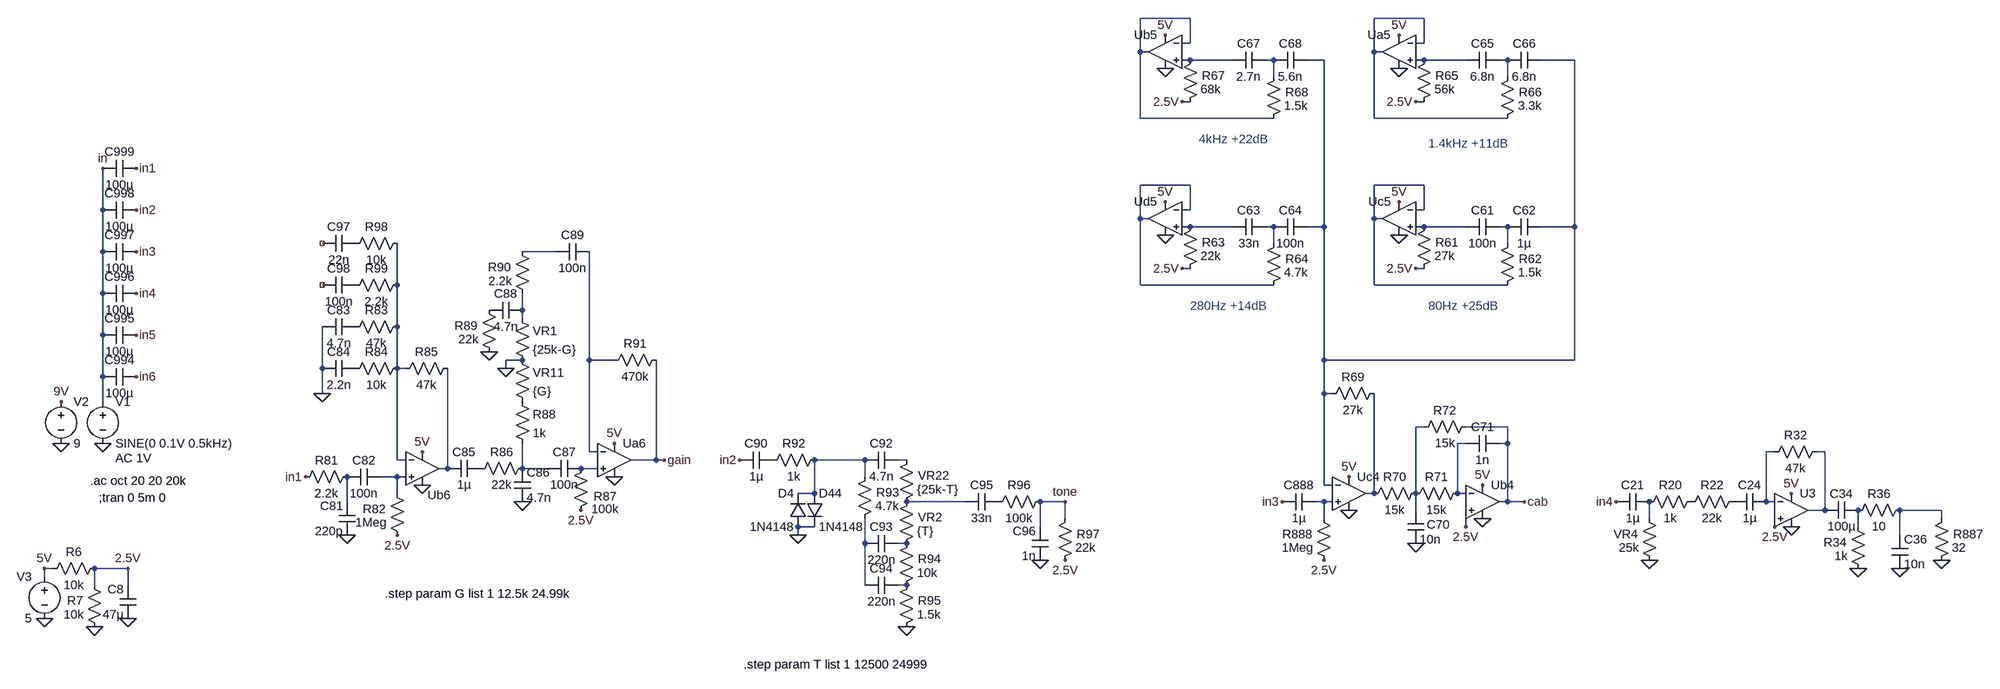
[diagram p0: schematic amPlug2ClassicRock.asc]
amPlug2ClassicRock.asc, the LTspice schematic file:
Version 4
SHEET 1 3408 3732
WIRE 608 336 512 336
WIRE 1056 336 960 336
WIRE 608 384 608 336
WIRE 608 384 592 384
WIRE 1056 384 1056 336
WIRE 1056 384 1040 384
WIRE 512 400 512 336
WIRE 528 400 512 400
WIRE 960 400 960 336
WIRE 976 400 960 400
WIRE 608 416 592 416
WIRE 688 416 608 416
WIRE 768 416 752 416
WIRE 864 416 832 416
WIRE 1056 416 1040 416
WIRE 1136 416 1056 416
WIRE 1216 416 1200 416
WIRE 1344 416 1280 416
WIRE 768 448 768 416
WIRE 1216 448 1216 416
WIRE 608 496 592 496
WIRE 1056 496 1040 496
WIRE 512 528 512 400
WIRE 768 528 512 528
WIRE 960 528 960 400
WIRE 1216 528 960 528
WIRE 608 656 512 656
WIRE 1056 656 960 656
WIRE -1568 704 -1568 624
WIRE 608 704 608 656
WIRE 608 704 592 704
WIRE 1056 704 1056 656
WIRE 1056 704 1040 704
WIRE 512 720 512 656
WIRE 528 720 512 720
WIRE 960 720 960 656
WIRE 976 720 960 720
WIRE 608 736 592 736
WIRE 688 736 608 736
WIRE 768 736 752 736
WIRE 864 736 864 416
WIRE 864 736 832 736
WIRE 1056 736 1040 736
WIRE 1136 736 1056 736
WIRE 1216 736 1200 736
WIRE 1344 736 1344 416
WIRE 1344 736 1280 736
WIRE 768 768 768 736
WIRE 1216 768 1216 736
WIRE -1568 784 -1568 704
WIRE -608 784 -672 784
WIRE 608 816 592 816
WIRE 1056 816 1040 816
WIRE -912 848 -912 768
WIRE 512 848 512 720
WIRE 768 848 512 848
WIRE 960 848 960 720
WIRE 1216 848 960 848
WIRE -1568 864 -1568 784
WIRE -672 896 -672 864
WIRE -672 912 -672 896
WIRE -912 928 -912 848
WIRE -1568 944 -1568 864
WIRE -672 992 -704 992
WIRE -544 992 -544 784
WIRE -496 992 -544 992
WIRE 864 992 864 736
WIRE 1344 992 1344 736
WIRE 1344 992 864 992
WIRE -1056 1008 -1056 928
WIRE -912 1008 -912 928
WIRE -896 1008 -912 1008
WIRE -704 1008 -704 992
WIRE -1568 1024 -1568 944
WIRE -1056 1056 -1056 1008
WIRE 864 1056 864 992
WIRE 880 1056 864 1056
WIRE -1568 1072 -1568 1024
WIRE 1056 1120 1040 1120
WIRE 1216 1120 1136 1120
WIRE 1136 1152 1120 1152
WIRE 1216 1152 1216 1120
WIRE 1216 1152 1200 1152
WIRE -544 1168 -544 992
WIRE -528 1168 -544 1168
WIRE 1728 1168 1712 1168
WIRE 1824 1168 1808 1168
WIRE -912 1184 -912 1008
WIRE -896 1184 -912 1184
WIRE -416 1184 -416 992
WIRE -416 1184 -464 1184
WIRE -400 1184 -416 1184
WIRE -16 1184 -112 1184
WIRE 64 1184 48 1184
WIRE -816 1200 -816 1008
WIRE -816 1200 -832 1200
WIRE -672 1200 -672 1152
WIRE -624 1200 -672 1200
WIRE -528 1200 -560 1200
WIRE -912 1216 -944 1216
WIRE -896 1216 -912 1216
WIRE -16 1216 -16 1184
WIRE 864 1232 864 1056
WIRE 880 1232 864 1232
WIRE -912 1248 -912 1216
WIRE -112 1248 -112 1184
WIRE -112 1248 -144 1248
WIRE 960 1248 960 1056
WIRE 960 1248 944 1248
WIRE 1040 1248 1040 1120
WIRE 1120 1248 1120 1152
WIRE 1136 1248 1120 1248
WIRE -1008 1264 -1008 1216
WIRE 176 1264 64 1264
WIRE 368 1264 320 1264
WIRE 864 1264 848 1264
WIRE 880 1264 864 1264
WIRE 1216 1264 1216 1152
WIRE 1216 1264 1200 1264
WIRE 1248 1264 1216 1264
WIRE 1712 1264 1712 1168
WIRE 1728 1264 1712 1264
WIRE 1040 1280 1040 1248
WIRE 1824 1280 1824 1168
WIRE 1824 1280 1792 1280
WIRE 2048 1280 1968 1280
WIRE 368 1296 368 1264
WIRE 864 1296 864 1264
WIRE 1488 1296 1488 1264
WIRE 2048 1296 2048 1280
WIRE -112 1312 -144 1312
WIRE 320 1312 320 1264
WIRE 1136 1312 1136 1280
WIRE 1728 1312 1728 1296
WIRE 1888 1312 1888 1280
WIRE -144 1328 -144 1312
WIRE 1968 1328 1968 1280
WIRE -16 1344 -16 1296
WIRE 64 1344 48 1344
WIRE -1664 1392 -1680 1392
WIRE -1520 1392 -1584 1392
WIRE -1680 1408 -1680 1392
WIRE -1584 1424 -1584 1392
WIRE -1520 1424 -1520 1392
WIRE -16 1424 -16 1344
WIRE 64 1424 48 1424
FLAG -1568 1152 0
FLAG -1568 624 in
FLAG -1648 1152 0
FLAG -1648 1072 9V
FLAG -1504 624 in1
FLAG -1504 704 in2
FLAG -1504 784 in3
FLAG -1504 864 in4
FLAG -1504 944 in5
FLAG -1504 1024 in6
FLAG -1088 1216 in1
FLAG -864 1168 5V
FLAG -864 1232 0
FLAG -1584 1504 0
FLAG -1520 1488 0
FLAG -1520 1392 2.5V
FLAG -1056 1056 0
FLAG -672 1264 0
FLAG -560 1280 2.5V
FLAG -1680 1488 0
FLAG -1680 1392 5V
FLAG -1008 1328 0
FLAG -912 1328 2.5V
FLAG -496 1152 5V
FLAG -496 1216 0
FLAG 64 1504 0
FLAG 320 1376 0
FLAG 368 1376 2.5V
FLAG 912 1216 5V
FLAG 912 1280 0
FLAG 864 1376 2.5V
FLAG 592 816 2.5V
FLAG 784 1264 in3
FLAG 592 496 2.5V
FLAG 1040 816 2.5V
FLAG 1040 496 2.5V
FLAG 1168 1232 5V
FLAG 1168 1296 0
FLAG 1040 1344 0
FLAG 1488 1376 0
FLAG 1760 1248 5V
FLAG 1760 1312 0
FLAG 1728 1312 2.5V
FLAG 1888 1392 0
FLAG 1968 1392 0
FLAG 1424 1264 in4
FLAG 2048 1376 0
FLAG -400 1184 gain
FLAG 368 1264 tone
FLAG 1248 1264 cab
FLAG -736 976 0
FLAG -704 1008 0
FLAG -144 1328 0
FLAG 1136 1312 2.5V
FLAG 560 368 5V
FLAG 560 432 0
FLAG 1008 368 5V
FLAG 1008 432 0
FLAG 560 688 5V
FLAG 560 752 0
FLAG 1008 688 5V
FLAG 1008 752 0
FLAG -256 1184 in2
SYMBOL voltage -1568 1056 R0
WINDOW 123 24 124 Left 2
WINDOW 39 0 0 Left 2
SYMATTR Value2 AC 1V
SYMATTR InstName V1
SYMATTR Value SINE(0 0.1V 0.5kHz)
SYMBOL voltage -1648 1056 R0
WINDOW 123 0 0 Left 0
WINDOW 39 0 0 Left 0
SYMATTR InstName V2
SYMATTR Value 9
SYMBOL cap -1504 688 R90
WINDOW 0 0 32 VBottom 2
WINDOW 3 32 32 VTop 2
SYMATTR InstName C998
SYMATTR Value 100µ
SYMBOL cap -1504 768 R90
WINDOW 0 0 32 VBottom 2
WINDOW 3 32 32 VTop 2
SYMATTR InstName C997
SYMATTR Value 100µ
SYMBOL cap -1504 848 R90
WINDOW 0 0 32 VBottom 2
WINDOW 3 32 32 VTop 2
SYMATTR InstName C996
SYMATTR Value 100µ
SYMBOL cap -1504 608 R90
WINDOW 0 0 32 VBottom 2
WINDOW 3 32 32 VTop 2
SYMATTR InstName C999
SYMATTR Value 100µ
SYMBOL cap -1504 928 R90
WINDOW 0 0 32 VBottom 2
WINDOW 3 32 32 VTop 2
SYMATTR InstName C995
SYMATTR Value 100µ
SYMBOL cap -1504 1008 R90
WINDOW 0 0 32 VBottom 2
WINDOW 3 32 32 VTop 2
SYMATTR InstName C994
SYMATTR Value 100µ
SYMBOL cap -944 1200 R90
WINDOW 0 0 32 VBottom 2
WINDOW 3 32 32 VTop 2
SYMATTR InstName C82
SYMATTR Value 100n
SYMBOL res -992 1200 R90
WINDOW 0 0 56 VBottom 2
WINDOW 3 32 56 VTop 2
SYMATTR InstName R81
SYMATTR Value 2.2k
SYMBOL Opamps\\UniversalOpamp2 -864 1200 R0
WINDOW 0 10 51 Left 2
SYMATTR InstName Ub6
SYMBOL res -800 992 R90
WINDOW 0 0 56 VBottom 2
WINDOW 3 32 56 VTop 2
SYMATTR InstName R85
SYMATTR Value 47k
SYMBOL res -1568 1376 R90
WINDOW 0 0 56 VBottom 2
WINDOW 3 32 56 VTop 2
SYMATTR InstName R6
SYMATTR Value 10k
SYMBOL res -1568 1520 R180
WINDOW 0 38 66 Left 2
WINDOW 3 36 40 Left 2
SYMATTR InstName R7
SYMATTR Value 10k
SYMBOL cap -1504 1488 R180
WINDOW 0 24 56 Left 2
WINDOW 3 24 8 Left 2
SYMATTR InstName C8
SYMATTR Value 47µ
SYMBOL res -896 1344 R180
WINDOW 0 38 66 Left 2
WINDOW 3 36 40 Left 2
SYMATTR InstName R82
SYMATTR Value 1Meg
SYMBOL res -896 992 R90
WINDOW 0 0 56 VBottom 2
WINDOW 3 32 56 VTop 2
SYMATTR InstName R84
SYMATTR Value 10k
SYMBOL cap -1056 1024 R270
WINDOW 0 32 32 VTop 2
WINDOW 3 0 32 VBottom 2
SYMATTR InstName C84
SYMATTR Value 2.2n
SYMBOL cap -752 1184 R90
WINDOW 0 0 32 VBottom 2
WINDOW 3 32 32 VTop 2
SYMATTR InstName C85
SYMATTR Value 1µ
SYMBOL res -656 1184 R90
WINDOW 0 0 56 VBottom 2
WINDOW 3 32 56 VTop 2
SYMATTR InstName R86
SYMATTR Value 22k
SYMBOL res -688 896 R0
SYMATTR InstName VR1
SYMATTR Value {25k-G}
SYMBOL res -688 976 R0
SYMATTR InstName VR11
SYMATTR Value {G}
SYMBOL cap -560 1184 R90
WINDOW 0 0 32 VBottom 2
WINDOW 3 32 32 VTop 2
SYMATTR InstName C87
SYMATTR Value 100n
SYMBOL cap -688 1264 M180
WINDOW 0 24 56 Left 2
WINDOW 3 24 8 Left 2
SYMATTR InstName C86
SYMATTR Value 4.7n
SYMBOL res -576 1296 M180
WINDOW 0 40 42 Left 2
WINDOW 3 36 18 Left 2
SYMATTR InstName R87
SYMATTR Value 100k
SYMBOL voltage -1680 1392 M0
WINDOW 123 0 0 Left 0
WINDOW 39 0 0 Left 0
SYMATTR InstName V3
SYMATTR Value 5
SYMBOL cap -992 1328 R180
WINDOW 0 24 56 Left 2
WINDOW 3 24 8 Left 2
SYMATTR InstName C81
SYMATTR Value 220p
SYMBOL Opamps\\UniversalOpamp2 -496 1184 R0
SYMATTR InstName Ua6
SYMBOL res -400 976 R90
WINDOW 0 0 56 VBottom 2
WINDOW 3 32 56 VTop 2
SYMATTR InstName R91
SYMATTR Value 470k
SYMBOL cap -608 800 R270
WINDOW 0 32 32 VTop 2
WINDOW 3 0 32 VBottom 2
SYMATTR InstName C89
SYMATTR Value 100n
SYMBOL cap -192 1168 R90
WINDOW 0 0 32 VBottom 2
WINDOW 3 32 32 VTop 2
SYMATTR InstName C90
SYMATTR Value 1µ
SYMBOL res -96 1168 R90
WINDOW 0 0 56 VBottom 2
WINDOW 3 32 56 VTop 2
SYMATTR InstName R92
SYMATTR Value 1k
SYMBOL diode -128 1312 R180
WINDOW 0 24 64 Left 2
WINDOW 3 24 0 Left 2
SYMATTR InstName D4
SYMATTR Value 1N4148
SYMBOL cap 48 1168 R90
WINDOW 0 0 32 VBottom 2
WINDOW 3 32 32 VTop 2
SYMATTR InstName C92
SYMATTR Value 4.7n
SYMBOL res -32 1312 M180
WINDOW 0 38 66 Left 2
WINDOW 3 36 40 Left 2
SYMATTR InstName R93
SYMATTR Value 4.7k
SYMBOL cap 48 1328 R90
WINDOW 0 0 32 VBottom 2
WINDOW 3 32 32 VTop 2
SYMATTR InstName C93
SYMATTR Value 220n
SYMBOL cap 48 1408 R90
WINDOW 0 0 32 VBottom 2
WINDOW 3 32 32 VTop 2
SYMATTR InstName C94
SYMATTR Value 220n
SYMBOL res 48 1440 M180
WINDOW 0 38 66 Left 2
WINDOW 3 36 40 Left 2
SYMATTR InstName R94
SYMATTR Value 10k
SYMBOL res 48 1520 M180
WINDOW 0 38 66 Left 2
WINDOW 3 36 40 Left 2
SYMATTR InstName R95
SYMATTR Value 1.5k
SYMBOL res 48 1360 M180
WINDOW 0 38 66 Left 2
WINDOW 3 36 40 Left 2
SYMATTR InstName VR2
SYMATTR Value {T}
SYMBOL res 48 1280 M180
WINDOW 0 38 66 Left 2
WINDOW 3 36 40 Left 2
SYMATTR InstName VR22
SYMATTR Value {25k-T}
SYMBOL cap 240 1248 R90
WINDOW 0 0 32 VBottom 2
WINDOW 3 32 32 VTop 2
SYMATTR InstName C95
SYMATTR Value 33n
SYMBOL res 336 1248 R90
WINDOW 0 0 56 VBottom 2
WINDOW 3 32 56 VTop 2
SYMATTR InstName R96
SYMATTR Value 100k
SYMBOL cap 336 1376 R180
WINDOW 0 24 56 Left 2
WINDOW 3 24 8 Left 2
SYMATTR InstName C96
SYMATTR Value 1n
SYMBOL res 352 1392 M180
WINDOW 0 38 66 Left 2
WINDOW 3 36 40 Left 2
SYMATTR InstName R97
SYMATTR Value 22k
SYMBOL Opamps\\UniversalOpamp2 912 1248 R0
SYMATTR InstName Uc4
SYMBOL res 976 1040 R90
WINDOW 0 0 56 VBottom 2
WINDOW 3 32 56 VTop 2
SYMATTR InstName R69
SYMATTR Value 27k
SYMBOL res 880 1392 R180
WINDOW 0 38 66 Left 2
WINDOW 3 36 40 Left 2
SYMATTR InstName R888
SYMATTR Value 1Meg
SYMBOL cap 848 1248 R90
WINDOW 0 0 32 VBottom 2
WINDOW 3 32 32 VTop 2
SYMATTR InstName C888
SYMATTR Value 1µ
SYMBOL res 592 832 M180
WINDOW 0 38 66 Left 2
WINDOW 3 36 40 Left 2
SYMATTR InstName R63
SYMATTR Value 22k
SYMBOL cap 752 720 R90
WINDOW 0 0 32 VBottom 2
WINDOW 3 32 32 VTop 2
SYMATTR InstName C63
SYMATTR Value 33n
SYMBOL cap 832 720 R90
WINDOW 0 0 32 VBottom 2
WINDOW 3 32 32 VTop 2
SYMATTR InstName C64
SYMATTR Value 100n
SYMBOL res 752 864 M180
WINDOW 0 38 66 Left 2
WINDOW 3 36 40 Left 2
SYMATTR InstName R64
SYMATTR Value 4.7k
SYMBOL res 592 512 M180
WINDOW 0 38 66 Left 2
WINDOW 3 36 40 Left 2
SYMATTR InstName R67
SYMATTR Value 68k
SYMBOL cap 752 400 R90
WINDOW 0 0 32 VBottom 2
WINDOW 3 32 32 VTop 2
SYMATTR InstName C67
SYMATTR Value 2.7n
SYMBOL cap 832 400 R90
WINDOW 0 0 32 VBottom 2
WINDOW 3 32 32 VTop 2
SYMATTR InstName C68
SYMATTR Value 5.6n
SYMBOL res 752 544 M180
WINDOW 0 38 66 Left 2
WINDOW 3 36 40 Left 2
SYMATTR InstName R68
SYMATTR Value 1.5k
SYMBOL res 1040 832 M180
WINDOW 0 38 66 Left 2
WINDOW 3 36 40 Left 2
SYMATTR InstName R61
SYMATTR Value 27k
SYMBOL cap 1200 720 R90
WINDOW 0 0 32 VBottom 2
WINDOW 3 32 32 VTop 2
SYMATTR InstName C61
SYMATTR Value 100n
SYMBOL cap 1280 720 R90
WINDOW 0 0 32 VBottom 2
WINDOW 3 32 32 VTop 2
SYMATTR InstName C62
SYMATTR Value 1µ
SYMBOL res 1200 864 M180
WINDOW 0 38 66 Left 2
WINDOW 3 36 40 Left 2
SYMATTR InstName R62
SYMATTR Value 1.5k
SYMBOL res 1040 512 M180
WINDOW 0 38 66 Left 2
WINDOW 3 36 40 Left 2
SYMATTR InstName R65
SYMATTR Value 56k
SYMBOL cap 1200 400 R90
WINDOW 0 0 32 VBottom 2
WINDOW 3 32 32 VTop 2
SYMATTR InstName C65
SYMATTR Value 6.8n
SYMBOL cap 1280 400 R90
WINDOW 0 0 32 VBottom 2
WINDOW 3 32 32 VTop 2
SYMATTR InstName C66
SYMATTR Value 6.8n
SYMBOL res 1200 544 M180
WINDOW 0 38 66 Left 2
WINDOW 3 36 40 Left 2
SYMATTR InstName R66
SYMATTR Value 3.3k
SYMBOL Opamps\\UniversalOpamp2 1168 1264 R0
SYMATTR InstName Ub4
SYMBOL cap 1024 1344 M180
WINDOW 0 37 36 Left 2
WINDOW 3 24 8 Left 2
SYMATTR InstName C70
SYMATTR Value 10n
SYMBOL cap 1200 1136 R90
WINDOW 0 0 32 VBottom 2
WINDOW 3 32 32 VTop 2
SYMATTR InstName C71
SYMATTR Value 1n
SYMBOL res 1136 1232 R90
WINDOW 0 0 56 VBottom 2
WINDOW 3 32 56 VTop 2
SYMATTR InstName R71
SYMATTR Value 15k
SYMBOL res 1056 1232 R90
WINDOW 0 0 56 VBottom 2
WINDOW 3 32 56 VTop 2
SYMATTR InstName R70
SYMATTR Value 15k
SYMBOL res 1584 1248 R90
WINDOW 0 0 56 VBottom 2
WINDOW 3 32 56 VTop 2
SYMATTR InstName R20
SYMATTR Value 1k
SYMBOL res 1664 1248 R90
WINDOW 0 0 56 VBottom 2
WINDOW 3 32 56 VTop 2
SYMATTR InstName R22
SYMATTR Value 22k
SYMBOL cap 1488 1248 R90
WINDOW 0 0 32 VBottom 2
WINDOW 3 32 32 VTop 2
SYMATTR InstName C21
SYMATTR Value 1µ
SYMBOL res 1504 1392 R180
WINDOW 0 38 66 Left 2
WINDOW 3 36 40 Left 2
SYMATTR InstName VR4
SYMATTR Value 25k
SYMBOL Opamps\\UniversalOpamp2 1760 1280 R0
SYMATTR InstName U3
SYMBOL res 1824 1152 R90
WINDOW 0 0 56 VBottom 2
WINDOW 3 32 56 VTop 2
SYMATTR InstName R32
SYMATTR Value 47k
SYMBOL cap 1888 1264 R90
WINDOW 0 0 32 VBottom 2
WINDOW 3 32 32 VTop 2
SYMATTR InstName C34
SYMATTR Value 100µ
SYMBOL res 1904 1408 R180
WINDOW 0 38 66 Left 2
WINDOW 3 36 40 Left 2
SYMATTR InstName R34
SYMATTR Value 1k
SYMBOL res 1984 1264 R90
WINDOW 0 0 56 VBottom 2
WINDOW 3 32 56 VTop 2
SYMATTR InstName R36
SYMATTR Value 10
SYMBOL cap 1952 1392 M180
WINDOW 0 24 56 Left 2
WINDOW 3 24 8 Left 2
SYMATTR InstName C36
SYMATTR Value 10n
SYMBOL res 2032 1392 M180
WINDOW 0 38 66 Left 2
WINDOW 3 36 40 Left 2
SYMATTR InstName R887
SYMATTR Value 32
SYMBOL res -896 912 R90
WINDOW 0 0 56 VBottom 2
WINDOW 3 32 56 VTop 2
SYMATTR InstName R83
SYMATTR Value 47k
SYMBOL cap -1056 944 R270
WINDOW 0 32 32 VTop 2
WINDOW 3 0 32 VBottom 2
SYMATTR InstName C83
SYMATTR Value 4.7n
SYMBOL res -896 832 R90
WINDOW 0 0 56 VBottom 2
WINDOW 3 32 56 VTop 2
SYMATTR InstName R99
SYMATTR Value 2.2k
SYMBOL res -896 752 R90
WINDOW 0 0 56 VBottom 2
WINDOW 3 32 56 VTop 2
SYMATTR InstName R98
SYMATTR Value 10k
SYMBOL cap -1056 784 R270
WINDOW 0 32 32 VTop 2
WINDOW 3 0 32 VBottom 2
SYMATTR InstName C97
SYMATTR Value 22n
SYMBOL cap -1056 864 R270
WINDOW 0 32 32 VTop 2
WINDOW 3 0 32 VBottom 2
SYMATTR InstName C98
SYMATTR Value 100n
SYMBOL res -656 880 R180
WINDOW 0 38 66 Left 2
WINDOW 3 36 40 Left 2
SYMATTR InstName R90
SYMATTR Value 2.2k
SYMBOL cap -736 912 R270
WINDOW 0 32 32 VTop 2
WINDOW 3 0 32 VBottom 2
SYMATTR InstName C88
SYMATTR Value 4.7n
SYMBOL res -720 992 R180
WINDOW 0 38 66 Left 2
WINDOW 3 36 40 Left 2
SYMATTR InstName R89
SYMATTR Value 22k
SYMBOL res -688 1056 R0
SYMATTR InstName R88
SYMATTR Value 1k
SYMBOL diode -128 1248 R0
SYMATTR InstName D44
SYMATTR Value 1N4148
SYMBOL res 1152 1104 R90
WINDOW 0 0 56 VBottom 2
WINDOW 3 32 56 VTop 2
SYMATTR InstName R72
SYMATTR Value 15k
SYMBOL Opamps\\UniversalOpamp2 560 400 M0
SYMATTR InstName Ub5
SYMBOL Opamps\\UniversalOpamp2 1008 400 M0
SYMATTR InstName Ua5
SYMBOL Opamps\\UniversalOpamp2 560 720 M0
SYMATTR InstName Ud5
SYMBOL Opamps\\UniversalOpamp2 1008 720 M0
SYMATTR InstName Uc5
SYMBOL cap 1712 1248 R90
WINDOW 0 0 32 VBottom 2
WINDOW 3 32 32 VTop 2
SYMATTR InstName C24
SYMATTR Value 1µ
TEXT -1592 1224 Left 2 !.ac oct 20 20 20k
TEXT -1576 1256 Left 2 !;tran 0 5m 0
TEXT -936 1440 Left 2 !.step param G list 1 12.5k 24.99k
TEXT -248 1576 Left 2 !.step param T list 1 12500 24999
TEXT 1064 888 Left 2 ;80Hz +25dB
TEXT 608 888 Left 2 ;280Hz +14dB
TEXT 624 568 Left 2 ;4kHz +22dB
TEXT 1064 576 Left 2 ;1.4kHz +11dB

The netlist it stands for:
* amPlug2ClassicRock.asc
V1 in 0 SINE(0 0.1V 0.5kHz) AC 1V
V2 9V 0 9
C998 in2 in 100µ
C997 in3 in 100µ
C996 in4 in 100µ
C999 in1 in 100µ
C995 in5 in 100µ
C994 in6 in 100µ
C82 N027 N029 100n
R81 N029 in1 2.2k
XUb6 N027 N015 5V 0 N024 level.2 Avol=1Meg GBW=10Meg Slew=10Meg ilimit=25m rail=0 Vos=0 phimargin=45 en=0 enk=0 in=0 ink=0 Rin=500Meg  ; pins IN+ IN- V+ V- OUT
R85 N024 N015 47k
R6 2.5V 5V 10k
R7 0 2.5V 10k
C8 0 2.5V 47µ
R82 2.5V N027 1Meg
R84 N015 P001 10k
C84 0 P001 2.2n
C85 P002 N024 1µ
R86 N025 P002 22k
R§VR1 N016 0 {25k-G}
R§VR11 0 P003 {G}
C87 N026 N025 100n
C86 0 N025 4.7n
R87 2.5V N026 100k
V3 5V 0 5
C81 0 N029 220p
XUa6 N026 N017 5V 0 gain level.2 Avol=1Meg GBW=10Meg Slew=10Meg ilimit=25m rail=0 Vos=0 phimargin=45 en=0 enk=0 in=0 ink=0 Rin=500Meg  ; pins IN+ IN- V+ V- OUT
R91 gain N017 470k
C89 N014 N017 100n
C90 P004 in2 1µ
R92 N022 P004 1k
D4 0 N022 1N4148
C92 N023 N022 4.7n
R93 N035 N022 4.7k
C93 N036 N035 220n
C94 N037 N035 220n
R94 N037 N036 10k
R95 0 N037 1.5k
R§VR2 N036 N030 {T}
R§VR22 N030 N023 {25k-T}
C95 P005 N030 33n
R96 tone P005 100k
C96 0 tone 1n
R97 2.5V tone 22k
XUc4 N031 N005 5V 0 N028 level.2 Avol=1Meg GBW=10Meg Slew=10Meg ilimit=25m rail=0 Vos=0 phimargin=45 en=0 enk=0 in=0 ink=0 Rin=500Meg  ; pins IN+ IN- V+ V- OUT
R69 N028 N005 27k
R888 2.5V N031 1Meg
C888 N031 in3 1µ
R63 2.5V N010 22k
C63 N011 N010 33n
C64 N005 N011 100n
R64 N008 N011 4.7k
R67 2.5V N003 68k
C67 N004 N003 2.7n
C68 N005 N004 5.6n
R68 N001 N004 1.5k
R61 2.5V N012 27k
C61 N013 N012 100n
C62 N005 N013 1µ
R62 N009 N013 1.5k
R65 2.5V N006 56k
C65 N007 N006 6.8n
C66 N005 N007 6.8n
R66 N002 N007 3.3k
XUb4 2.5V N019 5V 0 cab level.2 Avol=1Meg GBW=10Meg Slew=10Meg ilimit=25m rail=0 Vos=0 phimargin=45 en=0 enk=0 in=0 ink=0 Rin=500Meg  ; pins IN+ IN- V+ V- OUT
C70 0 N018 10n
C71 cab N019 1n
R71 N019 N018 15k
R70 N018 N028 15k
R20 P006 N033 1k
R22 P007 P006 22k
C21 N033 in4 1µ
R§VR4 0 N033 25k
XU3 2.5V N020 5V 0 N021 level.2 Avol=1Meg GBW=10Meg Slew=10Meg ilimit=25m rail=0 Vos=0 phimargin=45 en=0 enk=0 in=0 ink=0 Rin=500Meg  ; pins IN+ IN- V+ V- OUT
R32 N021 N020 47k
C34 N034 N021 100µ
R34 0 N034 1k
R36 N032 N034 10
C36 0 N032 10n
R887 0 N032 32
R83 N015 P008 47k
C83 0 P008 4.7n
R99 N015 P009 2.2k
R98 N015 P010 10k
C97 NC_01 P010 22n
C98 NC_02 P009 100n
R90 N016 N014 2.2k
C88 P011 N016 4.7n
R89 0 P011 22k
R88 P003 N025 1k
D44 N022 0 1N4148
R72 cab N018 15k
XUb5 N003 N001 5V 0 N001 level.2 Avol=1Meg GBW=10Meg Slew=10Meg ilimit=25m rail=0 Vos=0 phimargin=45 en=0 enk=0 in=0 ink=0 Rin=500Meg  ; pins IN+ IN- V+ V- OUT
XUa5 N006 N002 5V 0 N002 level.2 Avol=1Meg GBW=10Meg Slew=10Meg ilimit=25m rail=0 Vos=0 phimargin=45 en=0 enk=0 in=0 ink=0 Rin=500Meg  ; pins IN+ IN- V+ V- OUT
XUd5 N010 N008 5V 0 N008 level.2 Avol=1Meg GBW=10Meg Slew=10Meg ilimit=25m rail=0 Vos=0 phimargin=45 en=0 enk=0 in=0 ink=0 Rin=500Meg  ; pins IN+ IN- V+ V- OUT
XUc5 N012 N009 5V 0 N009 level.2 Avol=1Meg GBW=10Meg Slew=10Meg ilimit=25m rail=0 Vos=0 phimargin=45 en=0 enk=0 in=0 ink=0 Rin=500Meg  ; pins IN+ IN- V+ V- OUT
C24 N020 P007 1µ
.model D D
.lib standard.dio
.ac oct 20 20 20k
;tran 0 5m 0
.step param G list 1 12.5k 24.99k
.step param T list 1 12500 24999
* 80Hz +25dB
* 280Hz +14dB
* 4kHz +22dB
* 1.4kHz +11dB
.lib UniversalOpamps2.sub
.backanno
.end